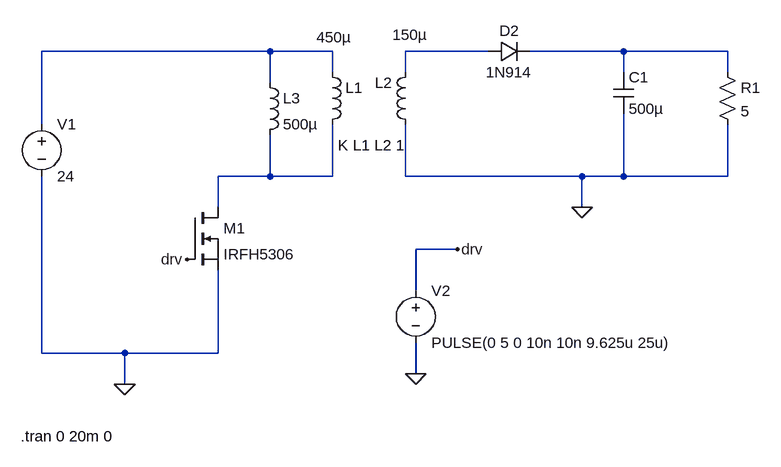
[diagram p0: schematic flyback.asc]
flyback.asc, the LTspice schematic file:
Version 4.1
SHEET 1 1068 680
WIRE 304 -128 -48 -128
WIRE 400 -128 304 -128
WIRE 640 -128 512 -128
WIRE 848 -128 704 -128
WIRE 1008 -128 848 -128
WIRE 400 -96 400 -128
WIRE 512 -96 512 -128
WIRE 848 -96 848 -128
WIRE 1008 -96 1008 -128
WIRE 304 -80 304 -128
WIRE -48 -16 -48 -128
WIRE 304 64 304 0
WIRE 304 64 224 64
WIRE 400 64 400 -16
WIRE 400 64 304 64
WIRE 512 64 512 -16
WIRE 784 64 512 64
WIRE 848 64 848 -32
WIRE 848 64 784 64
WIRE 1008 64 1008 -16
WIRE 1008 64 848 64
WIRE 224 112 224 64
WIRE 784 112 784 64
WIRE 592 176 528 176
WIRE 528 240 528 176
WIRE -48 336 -48 64
WIRE 80 336 -48 336
WIRE 224 336 224 208
WIRE 224 336 80 336
WIRE 528 368 528 320
WIRE 80 384 80 336
FLAG 80 384 0
FLAG 784 112 0
FLAG 528 368 0
FLAG 592 176 drv
FLAG 176 192 drv
SYMBOL nmos 176 112 R0
SYMATTR InstName M1
SYMATTR Value IRFH5306
SYMBOL voltage -48 -32 R0
WINDOW 123 0 0 Left 0
WINDOW 39 0 0 Left 0
SYMATTR InstName V1
SYMATTR Value 24
SYMBOL ind 384 -112 R0
WINDOW 3 18 -22 Bottom 2
SYMATTR InstName L1
SYMATTR Value 450µ
SYMATTR Type ind
SYMBOL ind 528 0 R180
WINDOW 0 36 80 Left 2
WINDOW 3 -18 154 Left 2
SYMATTR InstName L2
SYMATTR Value 150µ
SYMATTR Type ind
SYMBOL diode 640 -112 R270
WINDOW 0 32 32 VTop 2
WINDOW 3 0 32 VBottom 2
SYMATTR InstName D2
SYMATTR Value 1N914
SYMBOL cap 832 -96 R0
SYMATTR InstName C1
SYMATTR Value 500µ
SYMBOL res 992 -112 R0
SYMATTR InstName R1
SYMATTR Value 5
SYMBOL ind 288 -96 R0
SYMATTR InstName L3
SYMATTR Value 500µ
SYMBOL voltage 528 224 R0
WINDOW 123 0 0 Left 0
WINDOW 39 0 0 Left 0
SYMATTR InstName V2
SYMATTR Value PULSE(0 5 0 10n 10n 9.625u 25u)
TEXT 408 16 Left 2 !K L1 L2 1
TEXT -80 464 Left 2 !.tran 0 20m 0

The netlist it stands for:
* flyback.asc
M1 N004 drv 0 0 IRFH5306
V1 N001 0 24
L1 N001 N004 450µ
L2 0 N002 150µ
D2 N002 N003 1N914
C1 N003 0 500µ
R1 N003 0 5
L3 N001 N004 500µ
V2 drv 0 PULSE(0 5 0 10n 10n 9.625u 25u)
.model D D
.lib standard.dio
.model NMOS NMOS
.model PMOS PMOS
.lib standard.mos
K L1 L2 1
.tran 0 20m 0
.backanno
.end